# EAGLE schematic bird_beaks 3.0 (EAGLE 9.6.2)

## Sheet 1 of 2
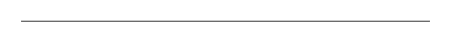
[diagram p0: schematic, sheet 1]

## Sheet 2 of 2
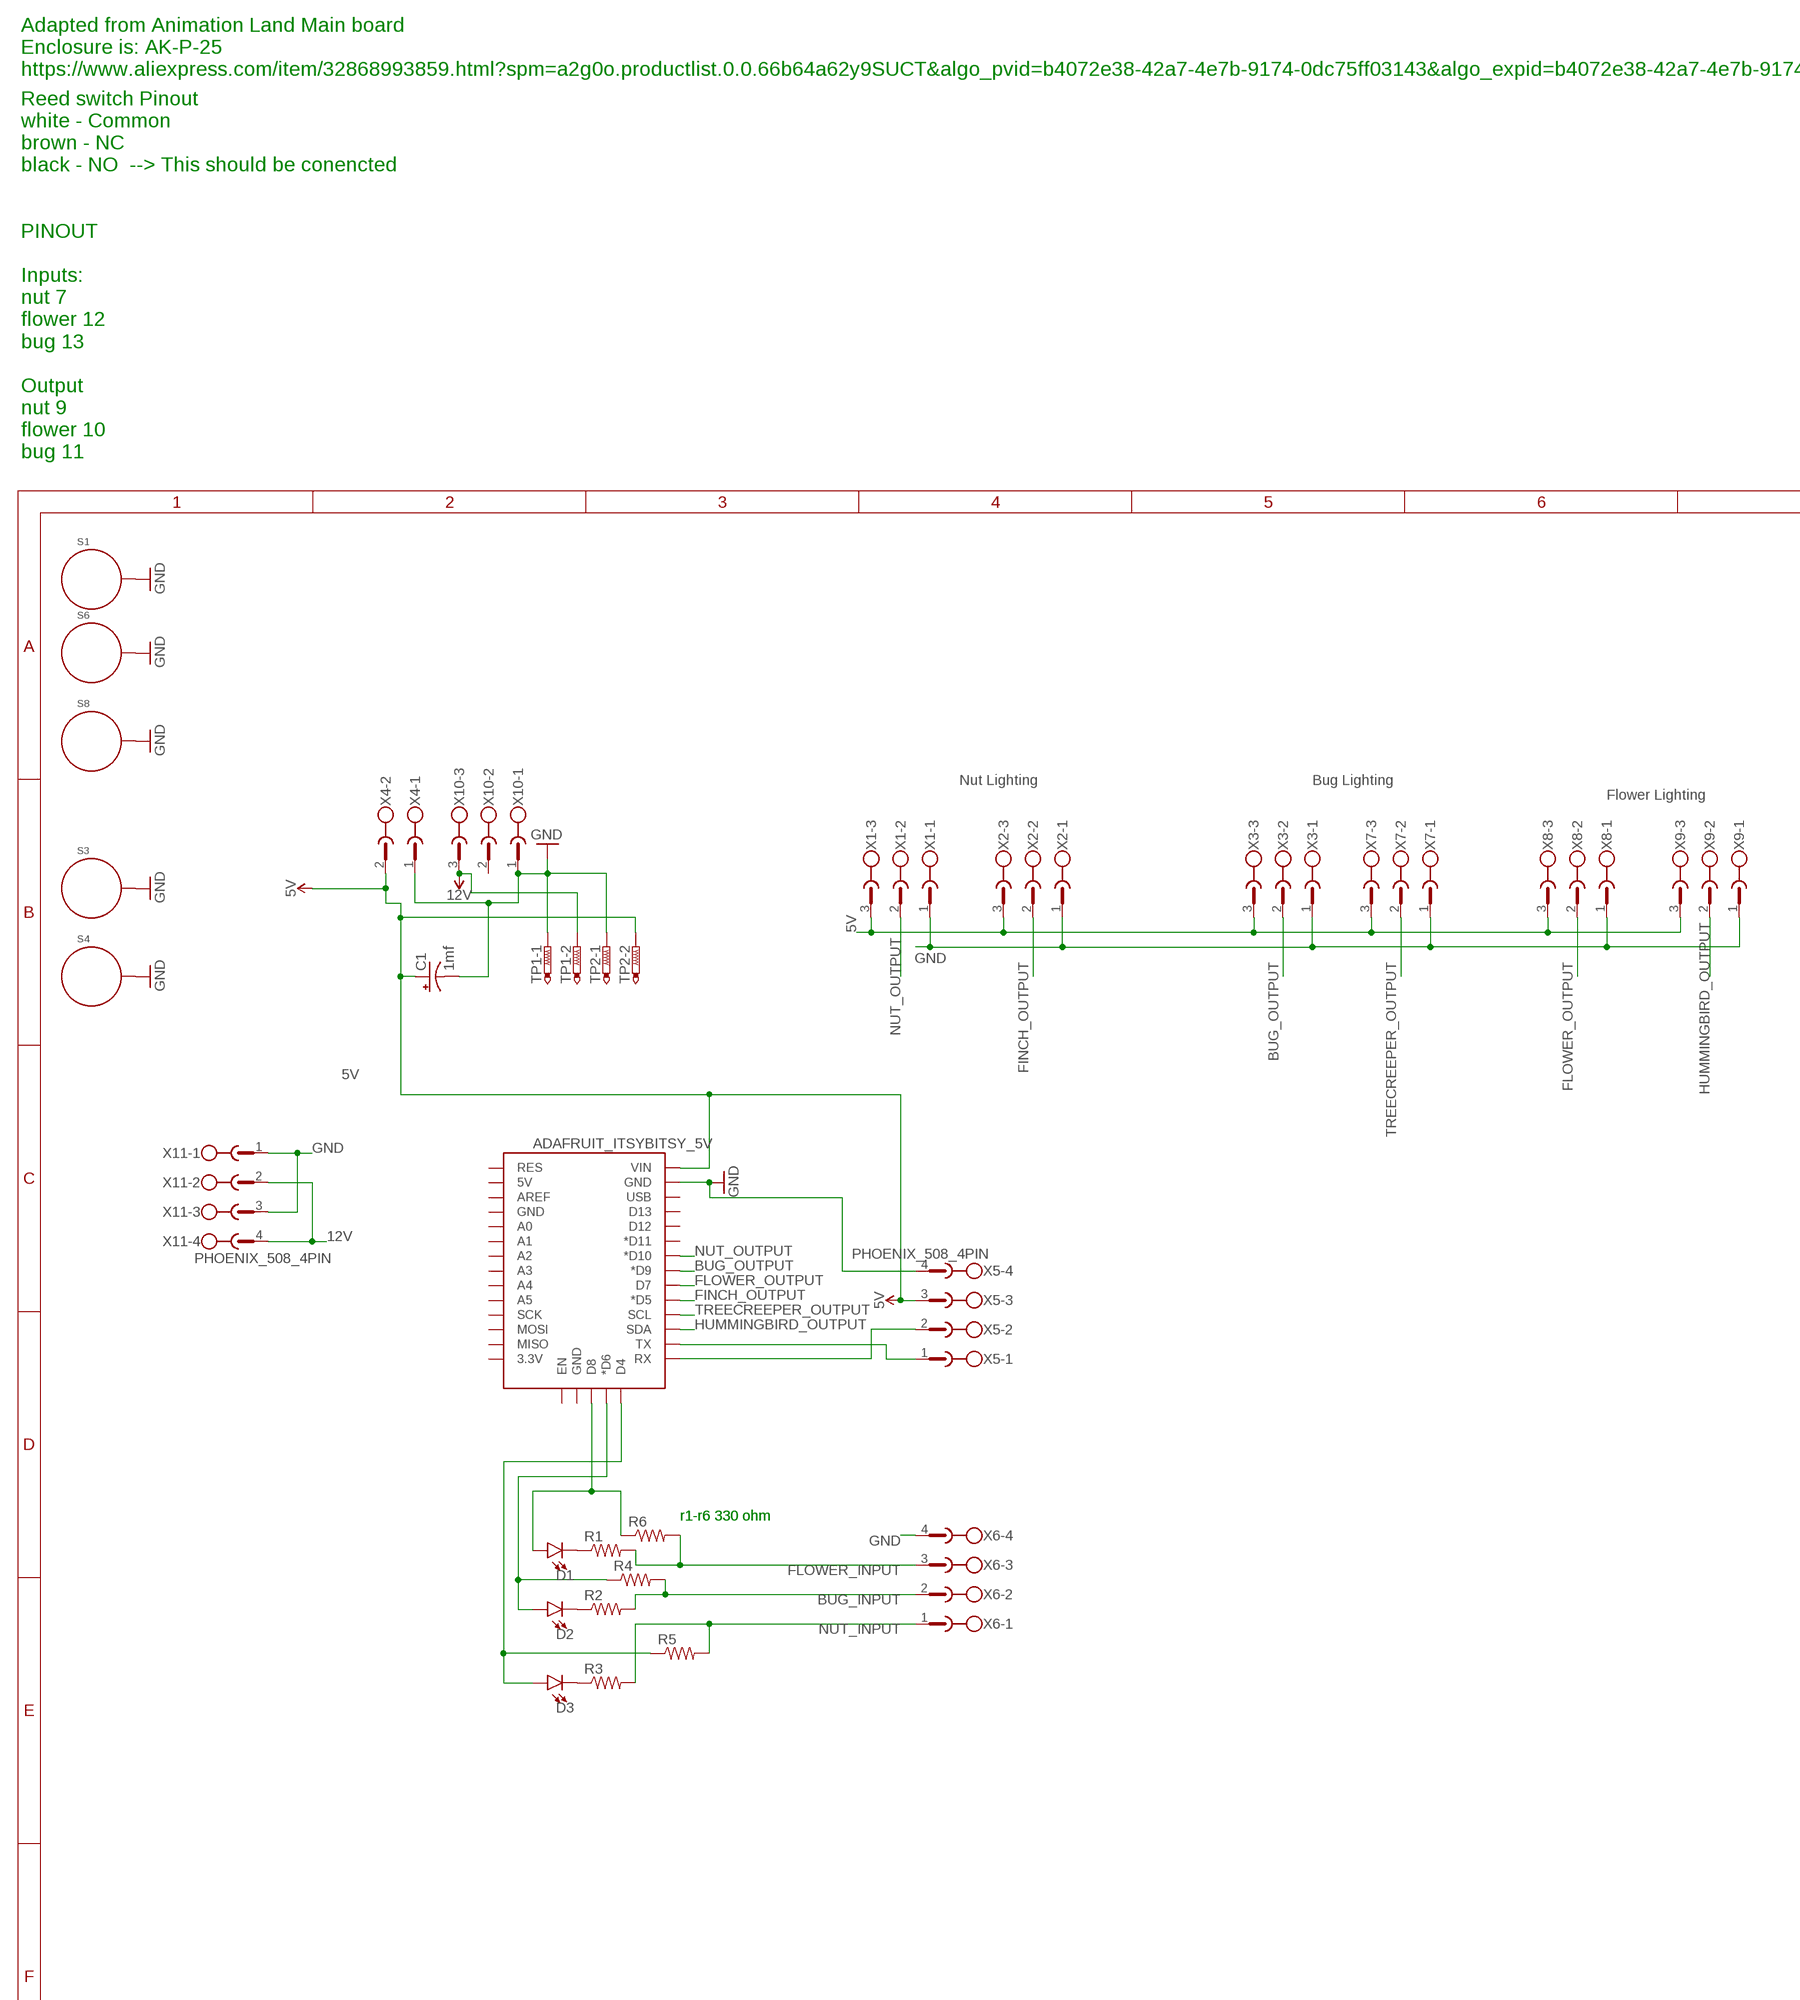
[diagram p1: schematic, sheet 2, part 1 of 2]
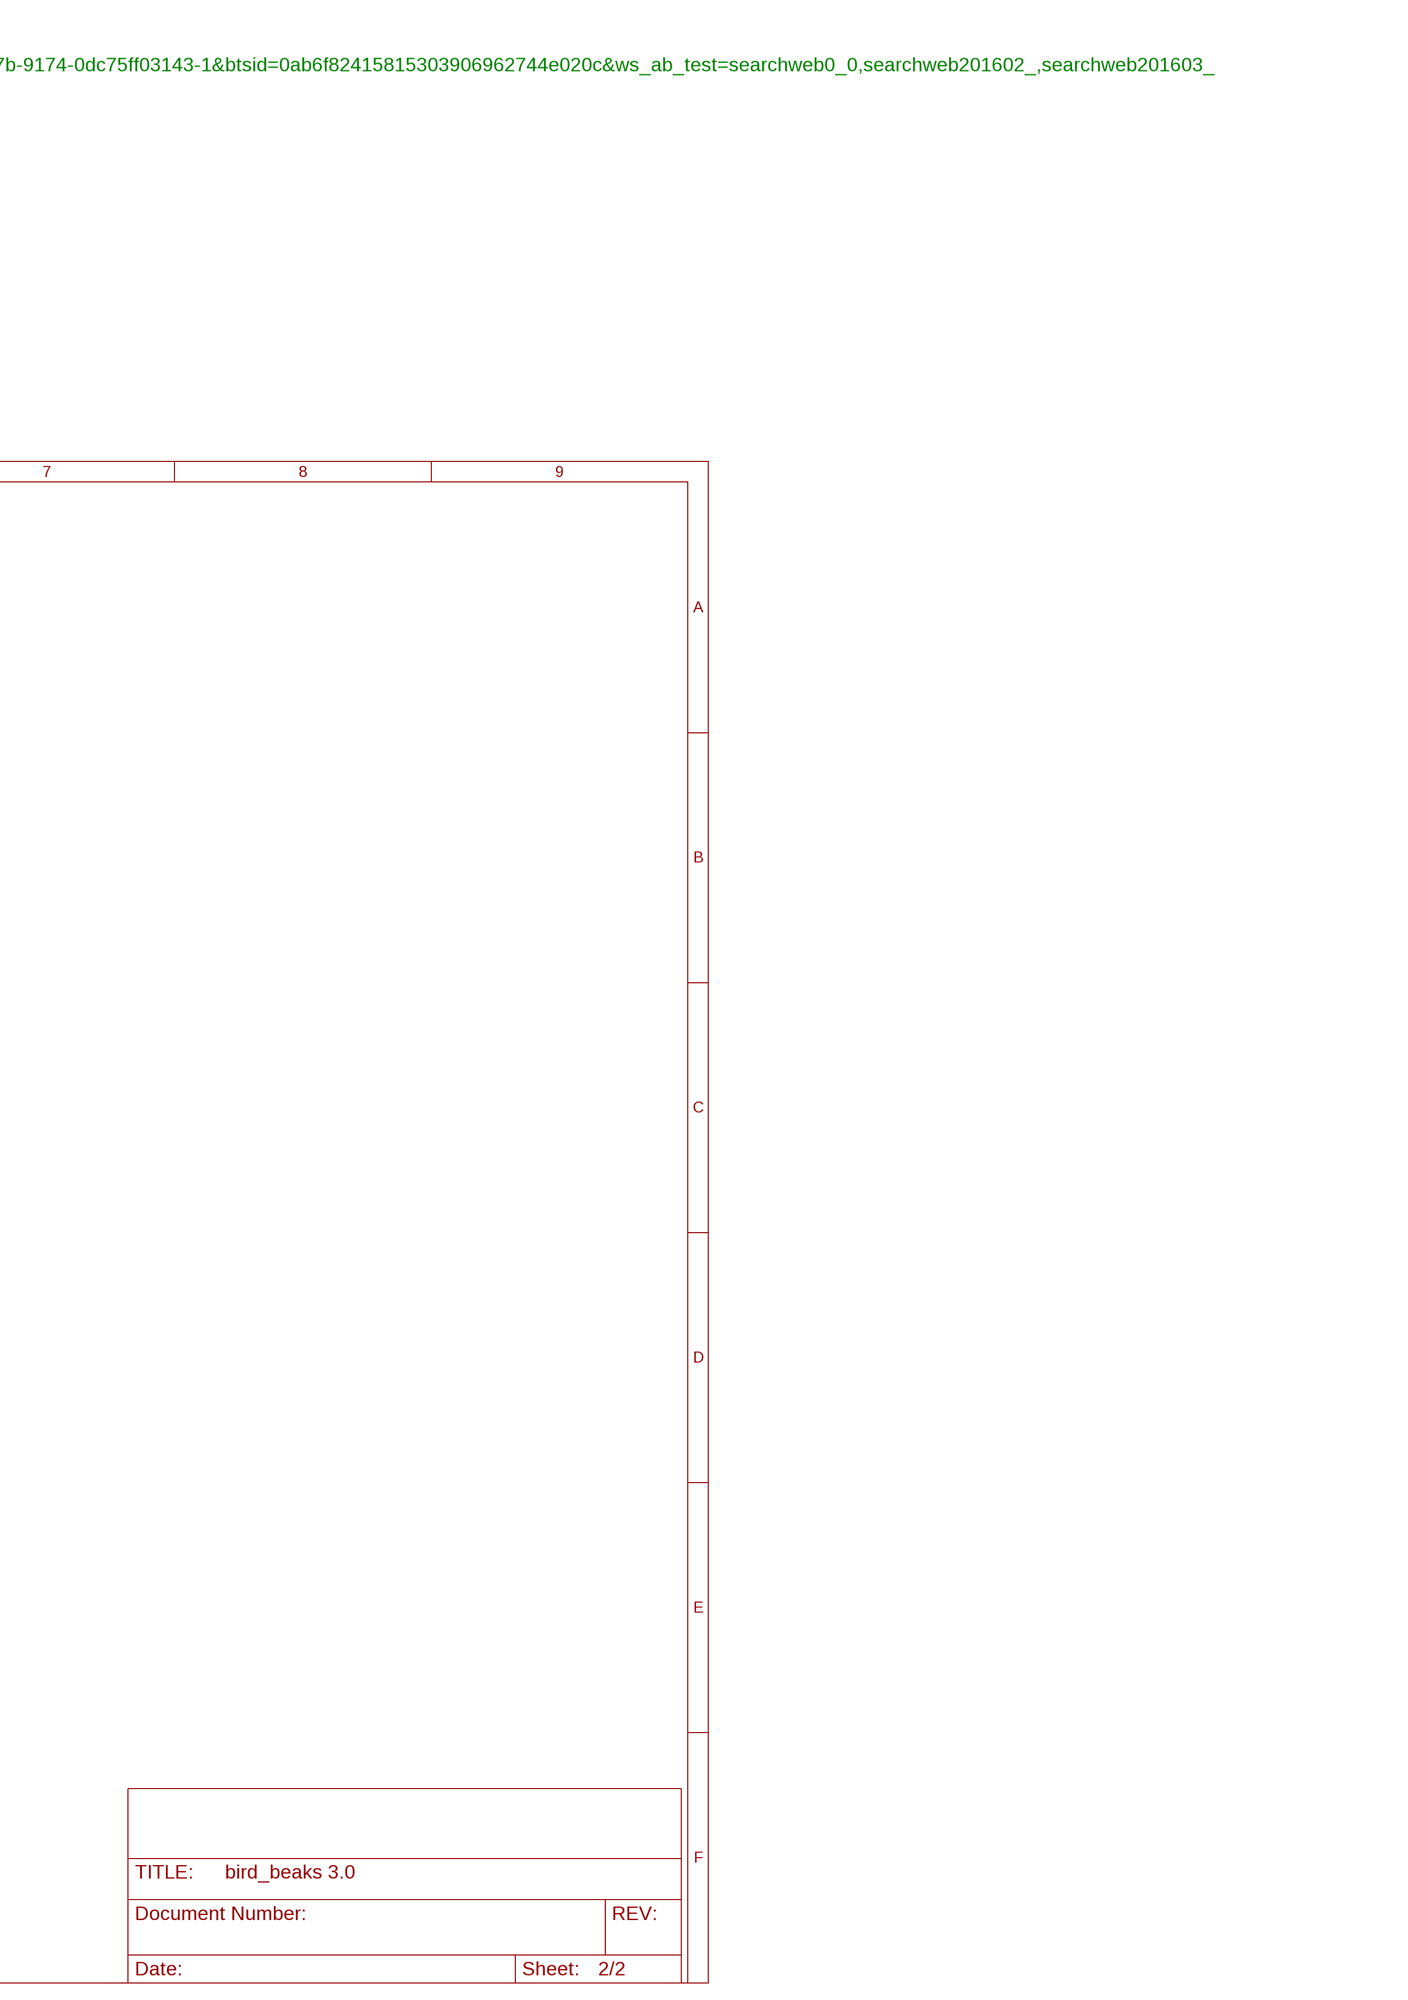
[diagram p2: schematic, sheet 2, part 2 of 2]

### Parts
C1  1mf  CAP_RADIAL_10MM-RADIAL-5MM-25V-20%  [CAP_RADIAL_10MM]
D1  SPARKFUN-LED_SFH4641SHORT  [SPARKFUN-LED_SFH4641-SHORT]
D2  SPARKFUN-LED_SFH4641SHORT  [SPARKFUN-LED_SFH4641-SHORT]
D3  SPARKFUN-LED_SFH4641SHORT  [SPARKFUN-LED_SFH4641-SHORT]
R1  RESISTORS0603-RES  [SMD_RESISTOR__0603]
R2  RESISTORS0603-RES  [SMD_RESISTOR__0603]
R3  RESISTORS0603-RES  [SMD_RESISTOR__0603]
R4  RESISTORS0402-RES  [SMD_RESISTOR_0402]
R5  RESISTORS0402-RES  [SMD_RESISTOR_0402]
R6  RESISTORS0402-RES  [SMD_RESISTOR_0402]
S1  STANDOFF_ELECTRICAL5-32  [STANDOFF_ELECTRICAL_5_32]
S3  STANDOFF_ELECTRICAL5-32  [STANDOFF_ELECTRICAL_5_32]
S4  STANDOFF_ELECTRICAL5-32  [STANDOFF_ELECTRICAL_5_32]
S6  STANDOFF_ELECTRICAL5-32  [STANDOFF_ELECTRICAL_5_32]
S8  STANDOFF_ELECTRICAL5-32  [STANDOFF_ELECTRICAL_5_32]
TP1  PTR2  [P2-38-17]
TP2  PTR2  [P2-38-17]
U1  ADAFRUIT_ITSYBITSY_5V  [ADAFRUIT_ITSYBITSY]
X1  PHOENIX_508_3PIN  [PHOENIX_508_3PIN]
X2  PHOENIX_508_3PIN  [PHOENIX_508_3PIN]
X3  PHOENIX_508_3PIN  [PHOENIX_508_3PIN]
X4  PHOENIX_508_2PIN  [PHOENIX_508_2PIN]
X5  PHOENIX_508_4PIN  [PHOENIX_508_4PIN]
X6  PHOENIX_508_4PIN  [PHOENIX_508_4PIN]
X7  PHOENIX_508_3PIN  [PHOENIX_508_3PIN]
X8  PHOENIX_508_3PIN  [PHOENIX_508_3PIN]
X9  PHOENIX_508_3PIN  [PHOENIX_508_3PIN]
X10  PHOENIX_508_3PIN  [PHOENIX_508_3PIN]
X11  PHOENIX_508_4PIN  [PHOENIX_508_4PIN]

### Nets
5V [High Power]: C1.+ TP2.TP-2 U1.VIN X1.3 X2.3 X3.3 X4.2 X5.3 X7.3 X8.3 X9.3
12V [High Power]: TP1.TP-2 X10.3 X11.2 X11.4
BUG_INPUT: R2.2 R4.2 X6.2
BUG_OUTPUT: U1.D9(*D9) X3.2
FINCH_OUTPUT: U1.D5(*D5) X2.2
FLOWER_INPUT: R1.2 R6.2 X6.3
FLOWER_OUTPUT: U1.D7 X8.2
GND [High Power]: C1.- S1.P1 S3.P1 S4.P1 S6.P1 S8.P1 TP1.TP-1 TP2.TP-1 U1.GND@2(GND) X1.1 X2.1 X3.1 X4.1 X5.4 X6.4 X7.1 X8.1 X9.1 X10.1 X11.1 X11.3
HUMMINGBIRD_OUTPUT: U1.SDA X9.2
N$1: D3.C R3.1
N$2: D2.C R2.1
N$3: D1.C R1.1
N$4: D1.A R6.1 U1.D8
N$5: D2.A R4.1 U1.D6(*D6)
N$6: D3.A R5.1 U1.D4
N$8: U1.TX X5.1
N$10: U1.RX X5.2
NUT_INPUT: R3.2 R5.2 X6.1
NUT_OUTPUT: U1.D10(*D10) X1.2
TREECREEPER_OUTPUT: U1.SCL X7.2
Unconnected: U1.3V(3.3V) U1.5V U1.A0 U1.A1 U1.A2 U1.A3 U1.A4 U1.A5 U1.AREF U1.D11(*D11) U1.D12 U1.D13 U1.EN U1.GND@0(GND) U1.GND@1(GND) U1.MISO U1.MOSI U1.RES U1.SCK U1.USB X10.2

### Notes on the sheet
- Adapted from Animation Land Main board
  Enclosure is: AK-P-25
  https://www.aliexpress.com/item/32868993859.html?spm=a2g0o.productlist.0.0.66b64a62y9SUCT&algo_pvid=b4072e38-42a7-4e7b-9174-0dc75ff03143&algo_expid=b4072e38-42a7-4e7b-9174-0dc75ff03143-1&btsid=0ab6f82415815303906962744e020c&ws_ab_test=searchweb0_0,searchweb201602_,searchweb201603_
- Reed switch Pinout
  white - Common
  brown - NC
  black - NO  --> This should be conencted
  
  
  PINOUT
  
  Inputs:
  nut 7
  flower 12
  bug 13
  
  Output
  nut 9
  flower 10
  bug 11
- Nut Lighting | Bug Lighting
- Flower Lighting
- r1-r6 330 ohm | r1-r6 330 ohm

## Library data of the parts
C1 = OMSI_Default_V1:CAP_RADIAL_10MM: 1,000µF/1mF ceramic capacitors A capacitor is a passive two-terminal electrical component used to store electrical energy temporarily in an electric field. CAP-08070; PROD_ID: CAP-09538
D1-D3 = OMSI_Default_V1:SPARKFUN-LED_SFH4641: OSRAM SFH 4641-Z - Infrared Emitters - High Power Infrared 940nm Wavelength:950nm Beam Angle:20 degree Forward Current:70mA Forward Voltage:1.6V Variants: Large:Large pads Narrow:Narrow pads Oversize:Oversize pads Short:Short pads Short2:Short, wide pads SparkFun Products: ZX Distance and Gesture Sensor <[https://www.sparkfun.com/products/13162]>; PROD_ID: DIO-11994
R1-R6 = OMSI_Default_V1:RESISTORS: Resistor Basic schematic elements and footprints for 0603, 1206, and PTH resistors.
S1 S3 S4 S6 S8 = th_libraries:STANDOFF_ELECTRICAL: A standoff intended to be an electrically connected point. Pad size and stop size allow for a #8 Phillips pan screw head to make a solid connection to the board. Added 144mill drill hole that fits my normal wood screw
TP1 TP2 = testpad:PTR2: TEST PIN
U1 = OMSI_Default_V1:ADAFRUIT_ITSYBITSY_5V: Adafruit ItsyBitsy 32u4 - 5V 16MHz https://www.adafruit.com/product/3677
X1-X3 X7-X10 = OMSI_Default_V1:PHOENIX_508_3PIN: PHOENIX; MF: FARNELL; MPN: 1757255; OC_FARNELL: 3705183; OC_NEWARK: 71C4162
X4 = OMSI_Default_V1:PHOENIX_508_2PIN: PHOENIX; MF: FARNELL; MPN: 1757242; OC_FARNELL: 3705171; OC_NEWARK: 71C4161
X5 X6 X11 = OMSI_Default_V1:PHOENIX_508_4PIN: PHOENIX; MF: FARNELL; MPN: 1757268; OC_FARNELL: 3705195; OC_NEWARK: 71C4163

## Net classes
0 Low Power: width 0.152 mm, drill 0.254 mm
1 High Power: width 1.27 mm, drill 0.483 mm